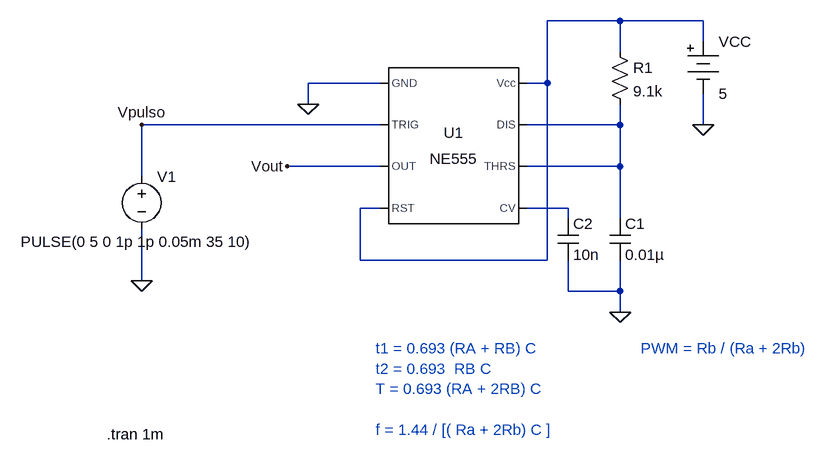
[diagram p0: schematic monoestable_test_2.asc]
monoestable_test_2.asc, the LTspice schematic file:
Version 4
SHEET 1 880 680
WIRE 384 -48 272 -48
WIRE 512 -48 384 -48
WIRE 512 -16 512 -48
WIRE 384 0 384 -48
WIRE 16 48 -96 48
WIRE 272 48 272 -48
WIRE 272 48 240 48
WIRE -96 80 -96 48
WIRE 16 112 -352 112
WIRE 384 112 384 80
WIRE 384 112 240 112
WIRE 512 112 512 64
WIRE 16 176 -128 176
WIRE 384 176 384 112
WIRE 384 176 240 176
WIRE -352 192 -352 112
WIRE 16 240 -16 240
WIRE 304 240 240 240
WIRE 304 256 304 240
WIRE 384 256 384 176
WIRE -16 320 -16 240
WIRE 272 320 272 48
WIRE 272 320 -16 320
WIRE -352 352 -352 272
WIRE 304 368 304 320
WIRE 384 368 384 320
WIRE 384 368 304 368
WIRE 384 400 384 368
FLAG 512 112 0
FLAG 384 400 0
FLAG -96 80 0
FLAG -352 352 0
FLAG -352 112 Vpulso
FLAG -128 176 Vout
SYMBOL Misc\\NE555 128 144 R0
SYMATTR InstName U1
SYMBOL Misc\\battery 512 -32 R0
WINDOW 123 0 0 Left 0
WINDOW 39 0 0 Left 0
SYMATTR InstName VCC
SYMATTR Value 5
SYMBOL res 368 -16 R0
SYMATTR InstName R1
SYMATTR Value 9.1k
SYMBOL cap 368 256 R0
SYMATTR InstName C1
SYMATTR Value 0.01µ
SYMBOL cap 288 256 R0
SYMATTR InstName C2
SYMATTR Value 10n
SYMBOL voltage -352 176 R0
WINDOW 3 -186 116 Left 2
WINDOW 123 0 0 Left 0
WINDOW 39 0 0 Left 0
SYMATTR InstName V1
SYMATTR Value PULSE(0 5 0 1p 1p 0.05m 35 10)
TEXT 8 456 Left 2 ;t1 = 0.693 (RA + RB) C\nt2 = 0.693  RB C\nT = 0.693 (RA + 2RB) C\n \nf = 1.44 / [( Ra + 2Rb) C ]
TEXT 416 456 Left 2 ;PWM = Rb / (Ra + 2Rb)
TEXT -406 588 Left 2 !.tran 1m

The netlist it stands for:
* monoestable_test_2.asc
XU1 0 Vpulso Vout N001 N003 N002 N002 N001 NE555  ; pins GND TRIG OUT RST CV THRS DIS Vcc
VCC N001 0 5
R1 N001 N002 9.1k
C1 N002 0 0.01µ
C2 N003 0 10n
V1 Vpulso 0 PULSE(0 5 0 1p 1p 0.05m 35 10)
* t1 = 0.693 (RA + RB) C
* t2 = 0.693  RB C
* T = 0.693 (RA + 2RB) C
* f = 1.44 / [( Ra + 2Rb) C ]
* PWM = Rb / (Ra + 2Rb)
.tran 1m
.lib NE555.sub
.backanno
.end